# EAGLE design zerocam2S_revD (EAGLE 9.6.1)
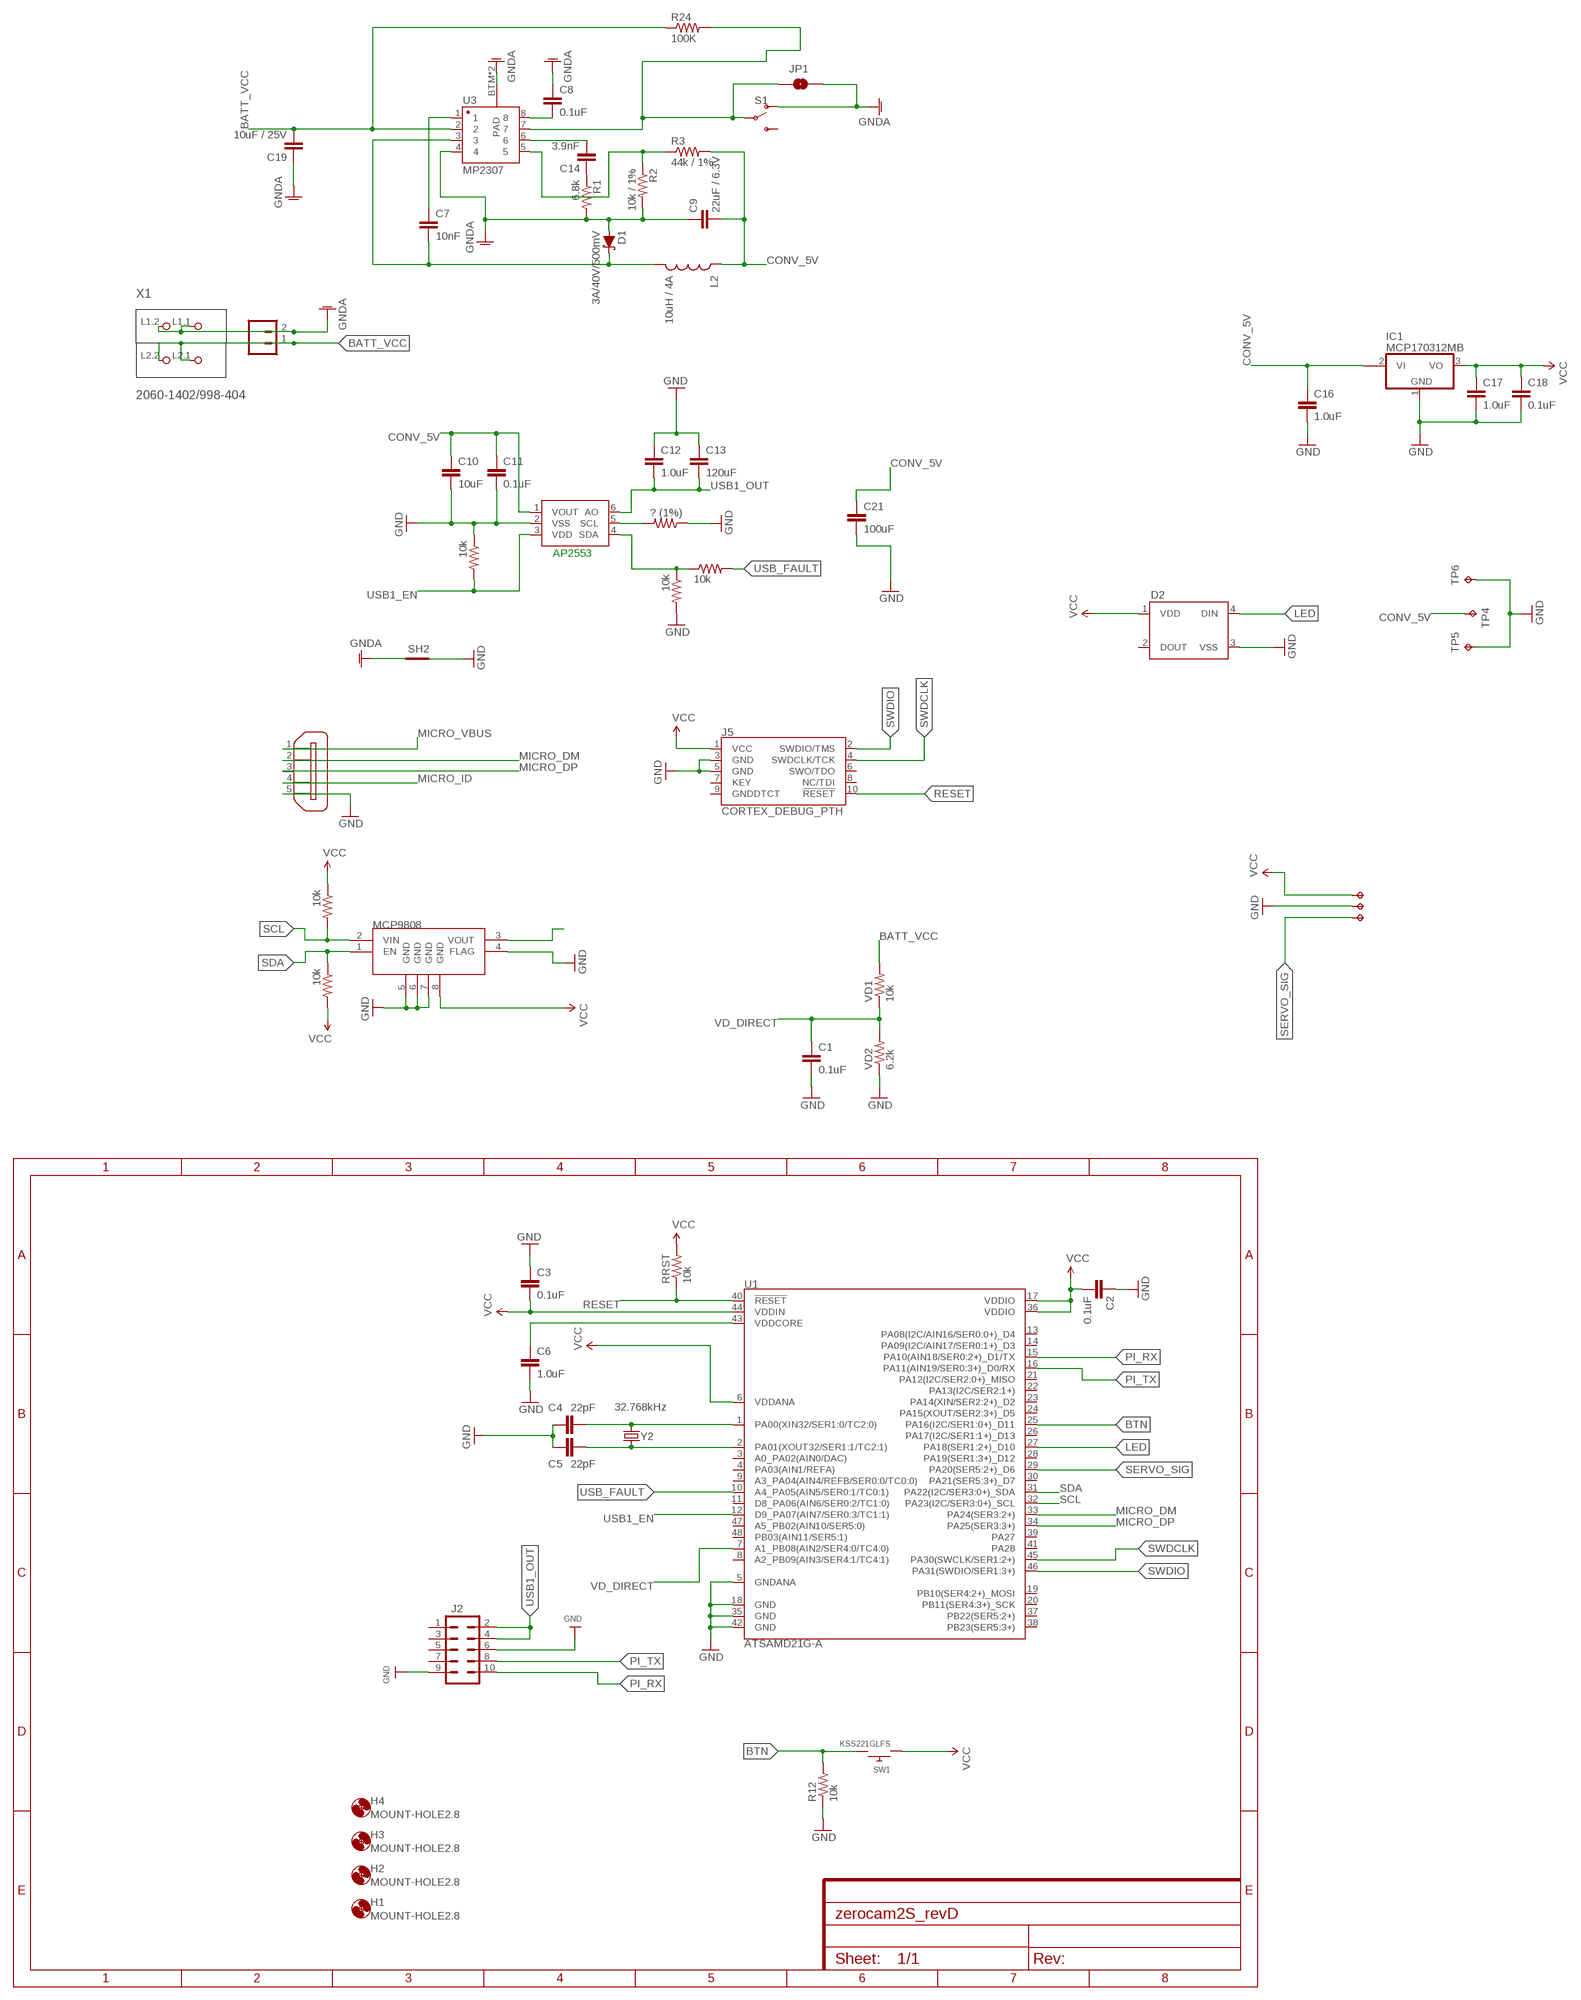
[diagram p0: schematic, sheet 1]

## Parts
AP2553  MCP4725  MCP4725SOT-23  [SOT23-6]
C1  0.1uF  CAP0805  [0805]
C2  0.1uF  1.0UF-0805-25V-10%  [0805]
C3  0.1uF  1.0UF-0805-25V-10%  [0805]
C4  22pF  CAP0805  [0805]
C5  22pF  CAP0805  [0805]
C6  1.0uF  1.0UF-0805-25V-10%  [0805]
C7  10nF  CAP0805  [0805]
C8  0.1uF  CAP1206  [1206]
C9  22uF / 6.3V  CAP1210  [1210]
C10  10uF  1.0UF-0805-25V-10%  [0805]
C11  0.1uF  1.0UF-0805-25V-10%  [0805]
C12  1.0uF  1.0UF-1206-50V-10%  [1206]
C13  120uF  1.0UF-1206-50V-10%  [1206]
C14  3.9nF  CAP1206  [1206]
C16  1.0uF  1.0UF-0805-25V-10%  [0805]
C17  1.0uF  1.0UF-1206-50V-10%  [1206]
C18  0.1uF  1.0UF-0805-25V-10%  [0805]
C19  10uF / 25V  CAP1210  [1210]
C21  100uF  10UF-1210-50V-20%  [1210]
D1  3A/40V/500mV  DIODE-SCHOTTKY-B340A  [SMA-DIODE]
D2  WS2812B  [WS2812B]
H1  MOUNT-HOLE2.8  [2,8]
H2  MOUNT-HOLE2.8  [2,8]
H3  MOUNT-HOLE2.8  [2,8]
H4  MOUNT-HOLE2.8  [2,8]
IC1  MCP170312MB  [SOT89]
J1  CONN_023.5MM-NO_SILK  [SCREWTERMINAL-3.5MM-2-NS]
J2  M05X2PTH  [AVR_ICSP]
J5  CORTEX_DEBUG_PTH  [2X5-PTH-1.27MM]
JP1  JUMPER-SMT_2_NO_NO-SILK  [SMT-JUMPER_2_NO_NO-SILK]
L2  10uH / 4A  INDUCTORSRU1038  [SRU1038]
MCP9808  V_REG_MIC5216  [MSOP8]
R1  6.8k  RESISTOR1206  [1206]
R2  10k / 1%  RESISTOR1206  [1206]
R3  44k / 1%  RESISTOR1206  [1206]
R12  10k  RESISTOR0805-RES  [0805]
R24  100K  RESISTOR1206  [1206]
R_I2C_1  10k  RESISTOR0805-RES  [0805]
R_I2C_2  10k  RESISTOR0805-RES  [0805]
R_MOSFET_USB1  ? (1%)  RESISTOR0805-RES  [0805]
R_MOSFET_USB2  10k  RESISTOR0805-RES  [0805]
R_MOSFET_USB3  10k  RESISTOR0805-RES  [0805]
R_MOSFET_USB4  10k  RESISTOR0805-RES  [0805]
RRST  10k  RESISTOR0805-RES  [0805]
S1  SWITCH-SPDT-SMD-RIGHT-ANGLE  [SWITCH_SPST_SMD_A]
SH2  SHORT-HT5  [SHORT_TOP-50]
SW1  KSS221GLFS  SWITCH_PUSHBUTTONC&K_KSS  [BTN_CK_KSS]
TP1  TPPAD1-13Y  [P1-13Y]
TP2  TPPAD1-13Y  [P1-13Y]
TP3  TPPAD1-13Y  [P1-13Y]
TP4  TPB2,54  [B2,54]
TP5  TPB2,54  [B2,54]
TP6  TPB2,54  [B2,54]
U1  ATSAMD21G-A  [TQFP-48]
U3  MP2307  GENERIC-SOIC8MSGEQ7N-FILTER  [SO08]
VD1  10k  RESISTOR0805-RES  [0805]
VD2  6.2k  RESISTOR0805-RES  [0805]
X1  2060-1402/998-404  [P-2060-1402/998-404]
X2  ZX62D-B-5PA8  [ZX62D-B-5PA8]
Y2  32.768kHz  CRYSTAL3.2X1.5MM  [CRYSTAL-SMD-3.2X1.5MM]

## Nets
BATT_VCC: C19.2 J1.1 R24.1 U3.2 VD1.2 X1.L2.1(P2.1) X1.L2.2(P2.2)
BTN: R12.2 SW1.P$2 U1.25(PA16(I2C/SER1:0+)_D11)
CONV_5V [power]: AP2553.1(VOUT) C9.2 C10.1 C11.1 C16.1 C21.1 IC1.2@1(VI1) L2.1 R3.2 TP4.TP
GND: AP2553.2(VSS) C1.2 C2.1 C3.1 C4.1 C5.1 C6.2 C10.2 C11.2 C12.1 C13.1 C16.2 C17.2 C18.2 C21.2 D2.3(VSS) IC1.1(GND) J2.6 J2.9 J5.3(GND) J5.5(GND) MCP9808.4(FLAG) MCP9808.5(GND) MCP9808.6(GND) MCP9808.7(GND) R12.1 R_MOSFET_USB1.1 R_MOSFET_USB2.2 R_MOSFET_USB3.1 SH2.2 TP2.TP TP5.TP TP6.TP U1.5(GNDANA) U1.18(GND) U1.35(GND) U1.42(GND) VD2.1 X2.5
GNDA [power]: C8.1 C9.1 C19.1 D1.A J1.2 JP1.2 R1.2 R2.2 S1.1(O) SH2.1 U3.4 U3.BTM(PAD) U3.P$1(PAD) X1.L1.1(P1.1) X1.L1.2(P1.2)
LED: D2.4(DIN) U1.27(PA18(SER1:2+)_D10)
MICRO_DM: U1.33(PA24(SER3:2+)) X2.2
MICRO_DP: U1.34(PA25(SER3:3+)) X2.3
MICRO_ID: X2.4
MICRO_VBUS: X2.1
N$1: C6.1 U1.43(VDDCORE)
N$3: AP2553.5(SCL) R_MOSFET_USB1.2
N$4: MCP9808.3(VOUT)
N$5: AP2553.4(SDA) R_MOSFET_USB2.1 R_MOSFET_USB4.1
N$8: C4.2 U1.1(PA00(XIN32/SER1:0/TC2:0)) Y2.P$2
N$25: C8.2 U3.8
N$26 [power]: C7.2 D1.C L2.2 U3.3
N$27: C7.1 U3.1
N$28: C14.1 R1.1
N$29: C14.2 U3.6
N$30: R2.1 R3.1 U3.5
N$32: C5.2 U1.2(PA01(XOUT32/SER1:1/TC2:1)) Y2.P$1
PB_BUCK_EN: JP1.1 R24.2 S1.2(P) U3.7
PI_RX: J2.10 U1.15(PA10(AIN18/SER0:2+)_D1/TX)
PI_TX: J2.8 U1.16(PA11(AIN19/SER0:3+)_D0/RX)
RESET: J5.10(!RESET) RRST.1 U1.40(!RESET!)
SCL: MCP9808.2(VIN) R_I2C_1.2 U1.32(PA23(I2C/SER3:0+)_SCL)
SDA: MCP9808.1(EN) R_I2C_2.1 U1.31(PA22(I2C/SER3:0+)_SDA)
SERVO_SIG: TP3.TP U1.29(PA20(SER5:2+)_D6)
SWDCLK: J5.4(SWDCLK/TCK) U1.45(PA30(SWCLK/SER1:2+))
SWDIO: J5.2(SWDIO/TMS) U1.46(PA31(SWDIO/SER1:3+))
USB1_EN: AP2553.3(VDD) R_MOSFET_USB3.2 U1.12(D9_PA07(AIN7/SER0:3/TC1:1))
USB1_OUT [power]: AP2553.6(AO) C12.2 C13.2 J2.2 J2.4
USB_FAULT: R_MOSFET_USB4.2 U1.10(A4_PA05(AIN5/SER0:1/TC0:1))
VCC [power]: C2.2 C3.2 C17.1 C18.1 D2.1(VDD) IC1.3(VO) J5.1(VCC) MCP9808.8(GND) R_I2C_1.1 R_I2C_2.2 RRST.2 SW1.P$1 TP1.TP U1.6(VDDANA) U1.17(VDDIO) U1.36(VDDIO) U1.44(VDDIN)
VD_DIRECT: C1.1 U1.7(A1_PB08(AIN2/SER4:0/TC4:0)) VD1.1 VD2.2
Unconnected: D2.2(DOUT) IC1.2(VI) J2.1 J2.3 J2.5 J2.7 J5.6(SWO/TDO) J5.7(KEY) J5.8(NC/TDI) J5.9(GNDDTCT) S1.3(S) U1.3(A0_PA02(AIN0/DAC)) U1.4(PA03(AIN1/REFA)) U1.8(A2_PB09(AIN3/SER4:1/TC4:1)) U1.9(A3_PA04(AIN4/REFB/SER0:0/TC0:0)) U1.11(D8_PA06(AIN6/SER0:2/TC1:0)) U1.13(PA08(I2C/AIN16/SER0:0+)_D4) U1.14(PA09(I2C/AIN17/SER0:1+)_D3) U1.19(PB10(SER4:2+)_MOSI) U1.20(PB11(SER4:3+)_SCK) U1.21(PA12(I2C/SER2:0+)_MISO) U1.22(PA13(I2C/SER2:1+)) U1.23(PA14(XIN/SER2:2+)_D2) U1.24(PA15(XOUT/SER2:3+)_D5) U1.26(PA17(I2C/SER1:1+)_D13) U1.28(PA19(SER1:3+)_D12) U1.30(PA21(SER5:3+)_D7) U1.37(PB22(SER5:2+)) U1.38(PB23(SER5:3+)) U1.39(PA27) U1.41(PA28) U1.47(A5_PB02(AIN10/SER5:0)) U1.48(PB03(AIN11/SER5:1)) X2.S1 X2.S2 X2.S3 X2.S4

## Notes on the sheet
- AP2553

## Library data of the parts
AP2553 = SparkFun-IC-Conversion:MCP4725: MCP4725 DAC Microchip 12-bit I2C DAC, SOT23-6 Datasheet <https://cdn.sparkfun.com/datasheets/BreakoutBoards/MCP4725_2009.pdf> SparkFun Products SparkFun I2C DAC Breakout - MCP4725 <https://www.sparkfun.com/products/12918> (BOB-12918); PROD_ID: IC-08886
C1 C7-C9 C14 C19 = SparkFun-Capacitors:CAP: Capacitor Standard 0603 ceramic capacitor, and 0.1" leaded capacitor.
C2 C3 C10 C11 C18 = SparkFun-Capacitors:1.0UF: 1µF ceramic capacitors A capacitor is a passive two-terminal electrical component used to store electrical energy temporarily in an electric field.; PROD_ID: CAP-08064; VALUE: 1.0uF
C4 C5 = SparkFun-Passives:CAP: Capacitor Standard 0603 ceramic capacitor, and 0.1" leaded capacitor.
C6 C16 = SparkFun-Capacitors:1.0UF: 1µF ceramic capacitors A capacitor is a passive two-terminal electrical component used to store electrical energy temporarily in an electric field.; PROD_ID: CAP-08064
C12 C17 = SparkFun-Capacitors:1.0UF: 1µF ceramic capacitors A capacitor is a passive two-terminal electrical component used to store electrical energy temporarily in an electric field.; PROD_ID: CAP-09822
C13 = SparkFun-Capacitors:1.0UF: 1µF ceramic capacitors A capacitor is a passive two-terminal electrical component used to store electrical energy temporarily in an electric field.; PROD_ID: CAP-09822; VALUE: 1.0uF
C21 = SparkFun-Capacitors:10UF: 10.0µF ceramic capacitors A capacitor is a passive two-terminal electrical component used to store electrical energy temporarily in an electric field.; PROD_ID: CAP-09824; VALUE: 10uF
D1 = SparkFun-DiscreteSemi:DIODE-SCHOTTKY: Schottky diode A Schottky diode is a semiconductor diode which has a low forward voltage drop and a very fast switching action.; PROD_ID: DIO-09886
D2 = SparkFun-LED:WS2812B: WS2812B - Intelligent control LED integrated light source Technical Specifications: Power Supply Voltage (VDD): 3.5 to 5.3 V Input Voltage (VI): -0.5 to VDD+0.5 V Operating Junction Temperature (Topt): -25°C to +80°C Storage Temperature Range (Tstg): -55°C to +150°C; PROD_ID: DIO-12503
H1-H4 = holes:MOUNT-HOLE: MOUNTING HOLE with drill center marker
IC1 = linear:MCP1703*: 250 mA, 16V, Low Quiescent Current LDO Regulator Source: http://ww1.microchip.com/downloads/en/DeviceDoc/22049b.pdf
J1 = SparkFun-Connectors:CONN_02: Multi connection point. Often used as Generic Header-pin footprint for 0.1 inch spaced/style header connections On any of the 0.1 inch spaced packages, you can populate with these: Break Away Headers - Straight <https://www.sparkfun.com/products/116> (PRT-00116) Break Away Male Headers - Right Angle <https://www.sparkfun.com/products/553> (PRT-00553) Female Headers <https://www.sparkfun.com/products/115> (PRT-00115) Break Away Headers - Machine Pin <https://www.sparkfun.com/products/117> (PRT-00117) Break Away Female Headers - Swiss Machine Pin <https://www.sparkfun.com/products/743> (PRT-00743) For SCREWTERMINALS and SPRING TERMINALS visit here: Screw Terimnals on SparkFun.com <https://www.sparkfun.com/search/results?term=Screw+Terminals> (5mm/3.5mm/2.54mm spacing) This device is also useful as a general connection point to wire up your design to another part of your project. Our various solder wires solder well into these plated through hole pads. Hook-Up Wire - Assortment (Stranded, 22 AWG) <https://www.sparkfun.com/products/11375> (PRT-11375) Hook-Up Wire - Assortment (Solid Core, 22 AWG) <https://www.sparkfun.com/products/11367> (PRT-11367) View the entire wire category on our website here <https://www.sparkfun.com/categories/141> Special notes: Molex polarized connector foot print use with: PRT-08233 with associated crimp pins and housings. 2.54_SCREWTERM for use with PRT-10571. 3.5mm Screw Terminal footprints for PRT-08084 5mm Screw Terminal footprints for use with PRT-08432; PROD_ID: CONN-08399
J2 = SparkFun-Connectors:M05X2: Header 5x2 Standard 10-pin dual row 0.1" header. Commonly used with AVR-ISP. Use with Spark Fun Electronics SKU: PRT-00778
J5 = SparkFun-Connectors:CORTEX_DEBUG: Cortex Debug Connector - 10 pin Supports JTAG debug, Serial Wire debug, and Serial Wire Viewer. PTH and SMD connector options available. General Connector Information <http://infocenter.arm.com/help/topic/com.arm.doc.faqs/attached/13634/cortex_debug_connectors.pdf> Products: PTH Connector <http://www.digikey.com/product-detail/en/cnc-tech/3220-10-0100-00/1175-1627-ND/3883661> -via Digi-Key SparkFun PSoc <https://www.sparkfun.com/products/13229> SparkFun T <https://www.sparkfun.com/products/13810>
JP1 = SparkFun-Jumpers:JUMPER-SMT_2_NO: Normally open jumper This jumper has two pads in close proximity to each other. Apply solder to close the connection. Round pads are easier to solder for beginners, but are a lot larger. SparkFun Product that uses the round pads: SparkFun EL Sequencer <https://www.sparkfun.com/products/12781>
L2 = SparkFun-Passives:INDUCTOR: Inductors Basic Inductor/Choke - 0603 and 1206. Footprints are not proven and vary greatly between part numbers. INDUCTOR POWER 3.3UH 4.0A SMD 0.197" L x 0.197" W x 0.177" H (5.00mm x 5.00mm x 4.50mm)
MCP9808 = SparkFun-IC-Power:V_REG_MIC5216: 500mA LDO, MSOP8 for better dissipation; PROD_ID: IC-09527
R1-R3 R24 = SparkFun-Resistors:RESISTOR: Resistor Basic schematic elements and footprints for 0603, 1206, and PTH resistors.
R12 R_I2C_1 R_I2C_2 R_MOSFET_USB1-R_MOSFET_USB4 RRST VD1 VD2 = SparkFun-Passives:RESISTOR: Resistor Basic schematic elements and footprints for 0603, 1206, and PTH resistors.
S1 = SparkFun-Switches:SWITCH-SPDT: Single Pole, Double Throw (SPDT) Switch Single-pole, double-throw (SPDT) switch. Variant Overview SMD-AYZ0202 Surface Mount DPDT Switch <https://www.sparkfun.com/products/597> (COM-00597) Used on e.g. LilyPad Arduino USB - ATmega32U4 Board <https://www.sparkfun.com/products/12049> PTH-11.6X4.0MM SPDT Mini Power Switch <https://www.sparkfun.com/products/102> (COM-00102) Used on e.g. SparkFun Simon Says - Through-Hole Soldering Kit <https://www.sparkfun.com/products/10547> (KIT-10547) PTH-11.6X4.0MM-KIT KIT version of SPDT Mini Power Switch - Simplifies soldering by removing tStop of switch pins - only one side can be soldered. PTH-11.6X4.0MM-LOCK LOCK version of SPDT Mini Power Switch - Offset pins hold switch in place for easier soldering. SMD-RIGHT-ANGLE Surface Mount Right Angle Switch <https://www.sparkfun.com/products/10860> (COM-10860) Used on e.g. SparkFun ESP8266 Thing <https://www.sparkfun.com/products/13231>; PROD_ID: SWCH-10651; SF_SKU: COM-10860
SH2 = shorts:SHORT-H: Short between two nets; BOM: no
SW1 = adafruit:SWITCH_PUSHBUTTON: Buttons SOFTTOUCHSMD_SJ - Soft touch temporary push button (Super Junk Akihabara) Compatible with SKPMANE010 [Mouser: 688-SKPMAN] C&K_KSS = Digikey: KSS221GLFS
TP1-TP6 = testpad:TP: Test pad
U1 = SparkFun-IC-Microcontroller:ATSAMD21G: Atmel SAMD21G SMART ARM-Based Microcontroller The Atmel ® | SMART ™ SAM D21 is a series of low-power microcontrollers using the 32-bit ARM ® Cortex ® -M0+ processor, and ranging from 32- to 64-pins with up to 256KB Flash and 32KB of SRAM. The SAM D21 devices operate at a maximum frequency of 48MHz and reach 2.46 CoreMark/MHz. They are designed for simple and intuitive migration with identical peripheral modules, hex compatible code, identical linear address map and pin compatible migration paths between all devices in the product series. All devices include intelligent and flexible peripherals, Atmel Event System for inter-peripheral signaling, and support for capacitive touch button, slider and wheel user interfaces. Datasheet <https://cdn.sparkfun.com/datasheets/Dev/Arduino/Boards/Atmel-42181-SAM-D21_Datasheet.pdf> SparkFun Products SparkFun SAMD21 Mini Breakout <https://www.sparkfun.com/products/13664> (DEV-13664) SparkFun SAMD21 Dev Breakout <https://www.sparkfun.com/products/13672> (DEV-13672) (DEV-14926); PROD_ID: IC-13064
U3 = SparkFun-AnalogIC:GENERIC-SOIC8: A placeholder for generic narrow & wide SOIC8 foorptints - used on the DIP adapter board.; PROD_ID: IC-10141
X1 = con-wago_2060:2060-1402/998-404: Serie 2060, THR-Leiterplattenklemme mit Betätigungsdrückern im Gurt 2-polig / Series 2060, THR terminal block with push-buttons in tape-and-reel packing 2-pole Polzahl / Pole No.: 2 Rastermaß / Pitch: 4 mm Bemessungsspannung / Rated Voltage: 160 V Nennstrom / Nominal Current: 9 A Leiterquerschnitt / Conductor Size: 0.2 - 0.75 mm2 Anschlusstechnik / Connection Technology: CAGE CLAMP® S Leitereinführung (zur Platine) / Conductor entry angle (to PCB): 0 ° Farbe / Color: lichtgrau / light gray Stand: 01.01.2014. Die jeweils aktuellen Daten zu diesem Artikel finden Sie in unserem Produktkatalog, den Sie unter www.wago.com einsehen können. As of: 01/01/2014. Please find the newest data for this article in our product catalogue, which can be viewed under www.wago.com.
X2 = zx62d-b-5pa8-oshpark_10:ZX62D-B-5PA8: Micro USB Type B Connector - Standard, Shell Through Hole Source: http://www.hirose.co.jp/cataloge_hp/ed_ZX_20140804.pdf; MF: Hirose; MPN: ZX62D-B-5PA8; OC_FARNELL: 2300438; OC_NEWARK: 69W0712
Y2 = samd21-temp:CRYSTAL: Various standard crystals. Proven footprints.; PROD_ID: XTAL-13062

## Net classes
1 power: width 0.254 mm, clearance 0.203 mm
2 hub_power: width 0.584 mm, clearance 0.254 mm
4 highpower: clearance 0.305 mm

## Board
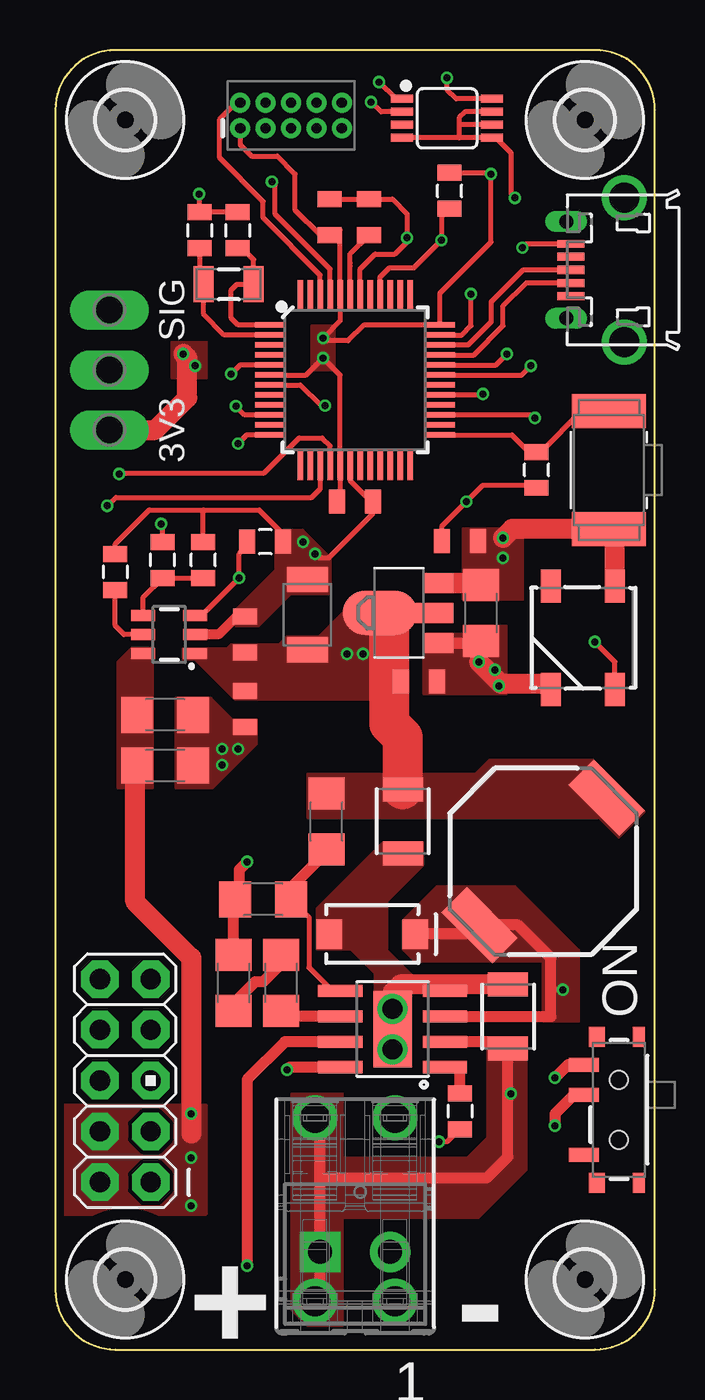
[diagram p1: board, top side]
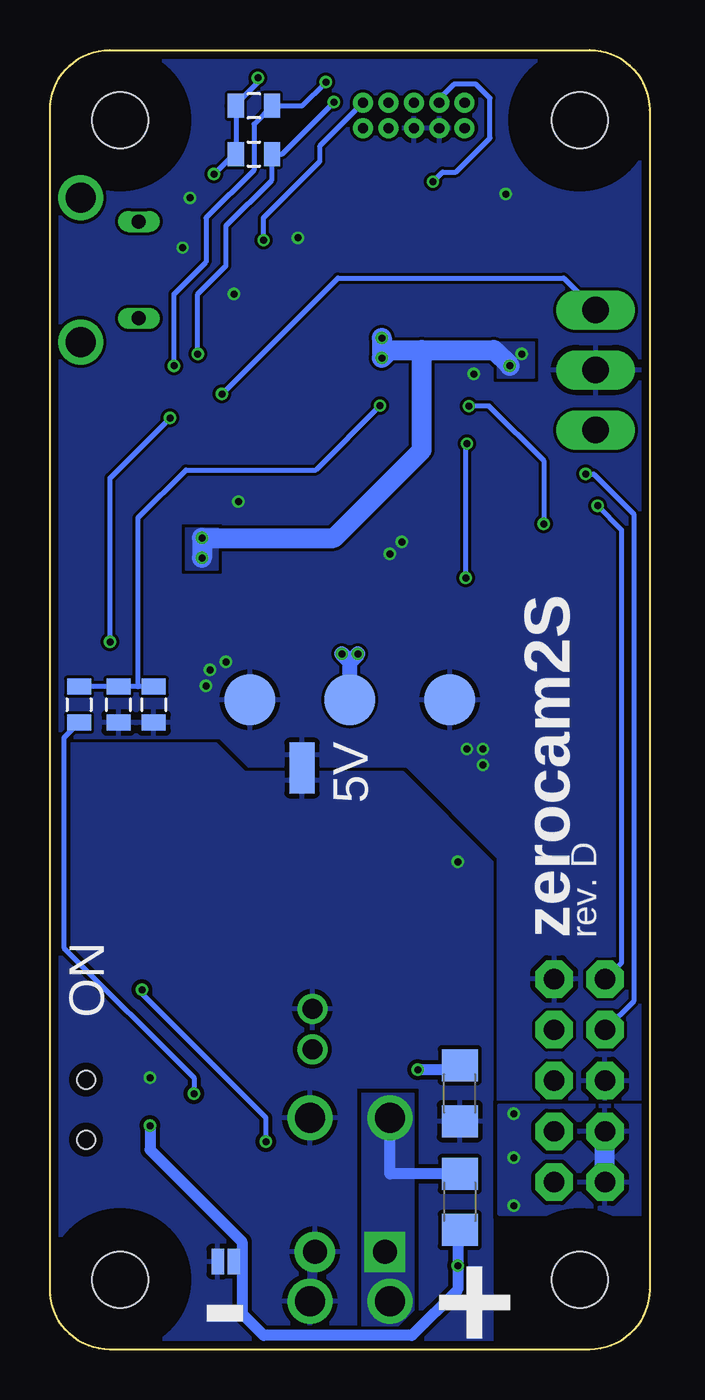
[diagram p2: board, bottom side, seen from below]

Size 30 x 65 mm. Coordinates in mm from the lower left corner, seen from the top.
Outline: 27,65 3,65 arc90 0,62 0,3 arc90 3,0 27,0 arc90 30,3 30,62 arc90 27,65
Copper layers (1*16): Top 0.035559375mm / dielectric 1.6mm / Bottom 0.035559375mm
Design rules "oshpark-2layer": minimum track width 6mil, minimum drill 10mil, track to track 6mil, track to pad 6mil, pad to pad 6mil, via to via 6mil, smd to smd 6mil, copper to edge 15mil, drill to drill 6mil, minimum pad ring 5mil, minimum via ring 5mil, stop-mask expansion 2.5mil, vias tented up to drill 0mil, thermal gap 10mil

### Footprints (pad centres in the part's own frame; a part is rotated, then mirrored left to right if it is on the bottom)
SOT23-6 = smd 0.55 x 1.2: 1 0.95,1.3; 2 0,1.3; 3 -0.95,1.3; 4 -0.95,-1.3; 5 0,-1.3; 6 0.95,-1.3
0805 = smd 0.8 x 1.2: 1 -0.9,0; 2 0.9,0
1206 = smd 1.6 x 1.8: 1 -1.4,0; 2 1.4,0
1210 = smd 1.2 x 2: 1 -1.6,0; 2 1.6,0
1210' = smd 1.27 x 2.06: 1 -1.755,0; 2 1.755,0
SMA-DIODE = smd 1.27 x 1.47: A -2.15,0; C 2.15,0
WS2812B = smd 1.651 x 1: 1 -2.577,1.6; 2 -2.577,-1.6; 3 2.577,-1.6; 4 2.577,1.6
2,8 = hole 2.8: 0,0
SOT89 = smd 1 x 1.5: 1 -1.499,-1.981; 3 1.499,-1.981 | smd 1 x 2: 2 0,-1.727 | smd 2.2 x 3.7: 2@1 0,0.94
SCREWTERMINAL-3.5MM-2-NS = drill 1.2 pad 2.032 square: 1 0,0 | drill 1.2 pad 2.032: 2 3.5,0
AVR_ICSP = drill 1.016 pad 1.88 octagon: 1 -1.27,5.08; 2 1.27,5.08; 3 -1.27,2.54; 4 1.27,2.54; 5 -1.27,0; 6 1.27,0; 7 -1.27,-2.54; 8 1.27,-2.54; 9 -1.27,-5.08; 10 1.27,-5.08
2X5-PTH-1.27MM = drill 0.508 pad 1: 1 -2.54,-0.635; 2 -2.54,0.635; 3 -1.27,-0.635; 4 -1.27,0.635; 5 0,-0.635; 6 0,0.635; 7 1.27,-0.635; 8 1.27,0.635; 9 2.54,-0.635; 10 2.54,0.635
SMT-JUMPER_2_NO_NO-SILK = smd 0.635 x 1.27: 1 -0.406,0; 2 0.406,0
SRU1038 = smd 1.8 x 3.6: 1 -4.5,0; 2 4.5,0
MSOP8 = smd 0.4 x 1.1: 1 -0.975,-2.25; 2 -0.325,-2.25; 3 0.325,-2.25; 4 0.975,-2.25; 5 0.975,2.25; 6 0.325,2.25; 7 -0.325,2.25; 8 -0.975,2.25
SWITCH_SPST_SMD_A = smd 0.7 x 1.5: 1 -2.25,-1.75; 2 -0.75,-1.75; 3 2.25,-1.75 | smd 1 x 0.6: GND1 -3.65,1; GND3 3.65,1 | smd 1 x 0.8: GND2 -3.65,-1.1; GND4 3.65,-1.1 | hole 0.9: -1.5,0; 1.5,0
SHORT_TOP-50 = smd 1.27 x 1.27: 1 0.635,0; 2 -0.635,0
BTN_CK_KSS = smd 1.7 x 3.7: P$1 -2.95,0; P$2 2.95,0
P1-13Y = drill 1.321 pad 1.905 long: TP 0,0
B2,54 = smd 2.54 x 2.54: TP 0,0
TQFP-48 = smd 1.5 x 0.28: 1 -4.25,2.75; 2 -4.25,2.25; 3 -4.25,1.75; 4 -4.25,1.25; 5 -4.25,0.75; 6 -4.25,0.25; 7 -4.25,-0.25; 8 -4.25,-0.75; 9 -4.25,-1.25; 10 -4.25,-1.75; 11 -4.25,-2.25; 12 -4.25,-2.75; 25 4.25,-2.75; 26 4.25,-2.25; 27 4.25,-1.75; 28 4.25,-1.25; 29 4.25,-0.75; 30 4.25,-0.25; 31 4.25,0.25; 32 4.25,0.75; 33 4.25,1.25; 34 4.25,1.75; 35 4.25,2.25; 36 4.25,2.75 | smd 0.28 x 1.5: 13 -2.75,-4.25; 14 -2.25,-4.25; 15 -1.75,-4.25; 16 -1.25,-4.25; 17 -0.75,-4.25; 18 -0.25,-4.25; 19 0.25,-4.25; 20 0.75,-4.25; 21 1.25,-4.25; 22 1.75,-4.25; 23 2.25,-4.25; 24 2.75,-4.25; 37 2.75,4.25; 38 2.25,4.25; 39 1.75,4.25; 40 1.25,4.25; 41 0.75,4.25; 42 0.25,4.25; 43 -0.25,4.25; 44 -0.75,4.25; 45 -1.25,4.25; 46 -1.75,4.25; 47 -2.25,4.25; 48 -2.75,4.25
SO08 = smd 0.61 x 2.21: 1 -1.905,-2.616; 2 -0.635,-2.616; 3 0.635,-2.616; 4 1.905,-2.616; 5 1.905,2.616; 6 0.635,2.616; 7 -0.635,2.616; 8 -1.905,2.616 | smd 3.81 x 1.93: BTM 0,0 | drill 1: P$1 1.016,0; P$2 -1.016,0
P-2060-1402/998-404 = drill 1.5: L1.1 4.595,2; L1.2 -4.595,2; L2.1 4.595,-2; L2.2 -4.595,-2
ZX62D-B-5PA8 = smd 1.35 x 0.4: 1 4.825,1.3; 2 4.825,0.65; 3 4.825,0; 4 4.825,-0.65; 5 4.825,-1.3 | drill 1.5: S1 2.15,-3.6; S2 2.15,3.6 | drill 0.7 long: S3 5.05,2.425; S4 5.05,-2.425
CRYSTAL-SMD-3.2X1.5MM = smd 1 x 1.8: P$1 -1.25,0; P$2 1.25,0

### Placement (x,y rotation side)
AP2553  5.7,35.76 270 top
C1  24.8,32.26 270 bottom
C2  14.99,42.42 180 top
C3  13.71,56.64 270 top
C4  9.12,55.99 270 top
C5  7.22,55.99 270 top
C6  15.69,56.64 90 top
C7  20.25,11.92 270 top
C8  9.5,12.82 90 bottom
C9  17.38,26.43 90 top
C10  9.5,32.04 270 top
C11  9.5,35.76 90 top
C12  5.48,29.21 180 top
C13  5.48,31.75 180 top
C14  11.28,18.33 270 top
C16  18.18,33.42 0 top
C17  21.28,36.84 270 top
C18  20.25,40.44 180 top
C19  22.64,16.66 270 top
C21  100uF  [1210']  12.61,36.76 90 top
D1  15.86,20.78 0 top
D2  26.4,35.6 270 top
H1  3.5,3.5 0 top
H2  26.5,3.5 0 top
H3  3.5,61.5 0 top
H4  26.5,61.5 0 top
IC1  17.18,36.84 90 top
J1  13.25,4.88 0 top
J2  3.5,13.45 180 top
J5  11.79,61.72 0 top
JP1  21.2,4.4 180 bottom
L2  24.4,24.41 225 top
MCP9808  19.6,61.58 270 top
R1  8.93,18.33 90 top
R2  10.39,22.52 180 top
R3  13.56,26.41 90 top
R12  24.07,44 90 top
R24  9.5,7.38 270 bottom
R_I2C_1  19.8,59.8 0 bottom
R_I2C_2  19.8,62.2 180 bottom
R_MOSFET_USB1  3,38.9 270 top
R_MOSFET_USB2  7.39,39.5 90 top
R_MOSFET_USB3  10.5,40.41 180 top
R_MOSFET_USB4  5.36,39.5 90 top
RRST  19.72,57.96 90 top
S1  28.2,12 270 top
SH2  17.39,29.09 270 bottom
SW1  27.7,44 90 top
TP1  2.7,46 90 top
TP2  2.7,49 90 top
TP3  2.7,52 90 top
TP4  15,32.5 0 bottom
TP5  20,32.5 0 bottom
TP6  10,32.5 0 bottom
U1  15,48.5 0 top
U3  16.87,16.03 90 top
VD1  28.54,32.26 270 bottom
VD2  26.57,32.26 90 bottom
X1  15,7 270 top
X2  30.61,54 180 top
Y2  8.67,53.28 0 top

### Tracks (layer width: path | path; a pad name or v marks a point on that pad's centre or on a via)
BATT_VCC  (via drill 0.35)
  Top 0.558: X1.L2.1 13.25,2.65 J1.1 13.25,8.6 | 13.25,8.6 13.25,11.35 X1.L2.2 | 13.25,8.6 21.6,8.6 22.64,9.64 C19.2
  Top 0.559: C19.2 22.31,15.39 U3.2
  Bottom 0.254: 28.75,31.15 VD1.2 29.3,30.6 29.3,20.1 22.8,13.6 v22.8,12.8
  Bottom 0.558: R24.1 12.98,8.78 13,8.8 X1.L2.2
  pour Bottom (no thermals): 14.4,1.2 12.6,1.2 11.8,2 11.8,12.8 14.4,12.8
  pour Top (no thermals): 23.6,15.6 21.6,15.6 21.6,10.6 20.6,9.6 13.8,9.6 13.8,6.6 21.2,6.6 23.6,9
  pour Top (no thermals): 14.4,12.8 11.8,12.8 11.8,2 12.6,1.2 14.4,1.2
BTN
  Top 0.254: SW1.P$2 26.35,46.95 24.3,44.9 R12.2 23.7,44.9 22.85,45.75 U1.25
CONV_5V  (via drill 0.35)
  Top 0.508: IC1.2@1 17.29,35.8 17.38,35.8
  Top 0.558: C16.1 17.38,33.52 17.38,35.8
  Top 2: C9.2 17.38,30.62 16.7,31.3 16.7,36.6 16.46,36.84 IC1.2@1
  Bottom 0.75: TP4.TP 15,34.4 | 15,34.4 v15.4,34.8 | v14.6,34.8 15,34.4
  pour Top (no thermals): 12.6,28.8 12.6,26.6 27.2,26.6 28.2,25.6 29.5,26.9 26.91,29.49 21.69,29.49 21,28.8
  pour Top (no thermals): 6.4,34.5 6.4,35.1 8.6,35.1 8.8,35.3 11.2,35.3 11.6,35.7 13.2,35.7 14.4,36.9 16,36.9 16,32.5 9,32.5 7,34.5
GND  (via drill 0.35)
  Top 0.254: 3.27,39.86 R_MOSFET_USB1.1 3,40.3 4.7,42 7.4,42 | X2.5 23.55,55.3 v23.37,55.12 | 20.2,60.6 MCP9808.5 22.05,60.6 22.8,59.85 22.8,57.8 v23,57.6 | 20.2,60.6 MCP9808.4 | MCP9808.7 20.5,61.91 20.2,61.6 20.2,61.2 | 20.2,61.2 20.2,60.6 | MCP9808.6 20.25,61.26 20.2,61.2 | U1.5 9.25,49.25 v8.8,48.8 | R12.1 23.95,43.22 21.37,43.22 v20.57,42.42 19.34,41.19 C18.2 | U1.35 20.35,50.75 20.8,51.2 v20.8,52.8 | U1.18 14.75,43.45 15.78,42.42 C2.1 15.89,41.82 13.67,39.6 13.2,39.6 v13,39.8 | 7.4,42 10.2,42 11.4,40.8 R_MOSFET_USB3.1 | R_MOSFET_USB2.2 7.39,41.99 7.4,42 | C4.1 C5.1 7.22,57.78 v7.2,57.8 | U1.42 15.25,54.05 16,54.8 17,54.8 17.6,55.4 v17.6,55.6 17.6,56.8 16.86,57.54 C6.2 C3.1
  Top 0.508: AP2553.2 7.04,35.8 8.2,35.8 9.06,36.66 C11.2
  Top 0.558: IC1.1 21.18,35.35
  Top 0.762: 21.18,35.35 C17.2
  Top 1: D2.3 24.52,33.3 22.3,33.3 v21.2,34.4
  other vias: 8.35,29.23 12.4,40.4 8.35,30.03 9.15,30.03 22.2,33.2 22,34
  pour Bottom (rank 3): 0,0 30,0 30,65 0,65
  pour Top (no thermals): 18.4,32.8 22.6,32.8 22.6,36.2 21.6,36.2 21.2,35.8 18.4,35.8
  pour Top (no thermals): 11,41 11,39 9,37 9,36.2 10.2,36.2 11.8,37.8 13.8,37.8 13.8,39.6 12.4,41
  pour Top (no thermals): 6,32.6 6,28.1 7.9,28.1 10.1,30.3 10.1,31.5 8.9,31.5 7.8,32.6
GNDA  (via drill 0.35)
  Top 0.5: U3.4 19.49,18.15 19.6,18.26
  Top 0.558: R1.2 8.93,22.45 R2.2 8.99,22.59 9.2,22.8 9.2,24 v9.6,24.4 | S1.1 25.65,14.25 v25,13.6
  Top 0.559: 8.79,19.86 R1.2 | R2.2 8.99,22.37
  Top 1: C19.1 19.6,18.26 17.26,18.26 16.87,17.87 U3.P$1
  pour Bottom (rank 2): 7.62,0 30,0 30,30.27 21.74,30.27 20.3,28.84 12.39,28.84 7.93,24.37 7.93,0.31
  pour Top (no thermals): 17.8,14.6 16,14.6 16,18.8 14.8,20 13.1,20 13.1,22.1 16.4,25.4 18.4,25.4 18.4,24.2 16.6,22.4 16.6,20 17.8,18.8
LED  (via drill 0.35)
  Top 0.254: D2.4 28,34.4 v27,35.4 | v24,46.6 23.85,46.75 U1.27
  Bottom 0.254: v27,35.4 27,43.6 v24,46.6
MICRO_DM
  Top 0.254: X2.2 23.55,53.35 22.4,52.2 22.4,51.2 20.95,49.75 U1.33
MICRO_DP
  Top 0.254: U1.34 20.65,50.25 21.8,51.4 21.8,52.4 23.4,54 X2.3
N$1
  Top 0.254: U1.43 14.75,54.2 14.75,54.35 14.75,54.8 C6.1
N$3
  Top 0.254: AP2553.5 3.44,35.76 3,36.2 R_MOSFET_USB1.2
N$5
  Top 0.254: AP2553.4 4.4,37.64 R_MOSFET_USB4.1 R_MOSFET_USB2.1
N$8
  Top 0.254: U1.1 9.15,51.25 8.8,51.6 8.8,53 9.08,53.28 Y2.P$2 9.92,54.52 9.33,55.09 C4.2
N$25  (via drill 0.35)
  Top 0.558: U3.8 11.72,14.12 v11.6,14
  Bottom 0.558: C8.2 9.72,14 v11.6,14
N$26  (via drill 0.35)
  Top 0.254: C7.2 20.22,11.02 19.6,10.4 v19.2,10.4 | v25.4,18 24.8,18
  Top 0.559: U3.3 24.8,16.66 24.8,18 24.8,19.58 23.15,21.23 L2.2 20.77,20.78 D1.C
  Bottom 0.254: v19.2,10.4 19.2,11.6 25.4,17.8 v25.4,18
  pour Top (no thermals): 24.4,19.4 18,19.4 17.4,20 17.4,21.5 19.1,23.2 23,23.2 26.2,20 26.2,16.4 24.4,16.4
N$27
  Top 0.558: C7.1 20.25,14.12 U3.1
N$28
  Top 0.558: C14.1 11.28,19.28 10.4,18.4 10,18.4 8.93,17.32 R1.1
  Top 0.559: R1.1 8.93,16.66
N$29
  Top 0.559: C14.2 11.55,16.66 U3.6
N$30
  Top 0.254: R2.1 12.68,21.64 12.68,19.11 13.86,17.93 U3.5
  Top 0.559: R2.1 11.79,23.12 13.62,24.95 R3.1
N$32
  Top 0.254: U1.2 8.45,50.75 7.42,51.78 Y2.P$1 7.22,53.48 C5.2
PB_BUCK_EN  (via drill 0.35)
  Top 0.558: 11.48,15.39 9.6,13.51 v9.6,4.2 | S1.2 25.95,12.75 25,11.8 v25,11.2
  Top 0.559: U3.7 11.48,15.39
  Bottom 0.508: JP1.1 20.4,4.4
  Bottom 0.558: v25,11.2 25,10 20.4,5.4 20.4,4.4 20.4,1.8 19.31,0.71 11.89,0.71 9.6,3 v9.6,4.2 9.6,5.9 R24.2
PI_RX  (via drill 0.35)
  Top 0.254: U1.15 13.25,43.05 12.82,42.62 3.02,42.62 v2.6,42.2
  Bottom 0.254: J2.10 1.4,19.36 1.4,41 v2.6,42.2
PI_TX  (via drill 0.35)
  Top 0.254: U1.16 13.75,45.2 13.35,45.6 12.2,45.6 10.41,43.81 3.21,43.81 v3.2,43.8
  Bottom 0.254: v3.2,43.8 2.8,43.8 0.8,41.8 0.8,17.42 J2.8
RESET  (via drill 0.35)
  Top 0.254: U1.40 16.25,53.65 16.71,54.11 17.95,54.11 v19.32,55.48 19.32,56.66 RRST.1
  Bottom 0.254: J5.10 16.51,60.18 16.51,59.42 19.32,56.61 v19.32,55.48
SCL  (via drill 0.35)
  Top 0.254: MCP9808.2 16.3,61.91 v15.8,62.4 | U1.32 22.05,49.25 v22.6,49.8
  Bottom 0.254: v15.8,62.4 18.4,59.8 R_I2C_1.2 18.9,58.5 21.2,56.2 21.2,54.2 22.6,52.8 v22.6,49.8
SDA  (via drill 0.35)
  Top 0.254: MCP9808.1 17.05,62.55 v16.2,63.4 | U1.31 23.35,48.75 v23.8,49.2
  Bottom 0.254: v16.2,63.4 17.4,62.2 R_I2C_2.1 19.8,61.3 19.8,59 22.2,56.6 22.2,54.4 23.8,52.8 v23.8,49.2
SERVO_SIG  (via drill 0.35)
  Top 0.254: v21.4,47.8 21.35,47.75 U1.29
  Bottom 0.254: v21.4,47.8 15.6,53.6 4.3,53.6 TP3.TP
SWDCLK  (via drill 0.35)
  Top 0.254: U1.45 13.75,54.05 11,56.8 11,58.25 v10.83,58.42
  Bottom 0.254: v10.83,58.42 10.36,58.89 9.69,58.89 7.98,60.6 7.98,62.59 8.69,63.3 9.78,63.3 10.52,62.56 J5.4
SWDIO
  Top 0.254: J5.2 9.05,62.36 8.22,61.53 8.22,59.6 10.4,57.42 10.4,56.6 13.25,53.75 U1.46
USB1_EN  (via drill 0.35)
  Top 0.254: U1.12 9.57,45.75 v9.14,45.32 | AP2553.3 7.31,36.71 v9.2,38.6 9.2,39.81 9.6,40.21 R_MOSFET_USB3.2
  Bottom 0.254: v9.2,38.6 9.2,45.26 v9.14,45.32
USB1_OUT  (via drill 0.35)
  Top 1: 6.8,10.8 6.8,19.6 4,22.4 4,29.13 C12.2
  Bottom 1: J2.2 J2.4
  other vias: 6.8,9.6 6.8,7.2 6.8,11.8
  pour Top (no thermals): 4.9,35.1 3.8,35.1 3.1,34.4 3.1,28.1 4.9,28.1
  pour Top (no thermals): 7.5,6.8 0,6.8 0,12.2 7.5,12.2
  pour Bottom: 0,6.8 7.5,6.8 7.5,12.2 0,12.2
USB_FAULT  (via drill 0.35)
  Top 0.254: U1.10 9.47,46.75 v9.03,47.19 | R_MOSFET_USB4.2 5.36,41.3 v5.3,41.3
  Bottom 0.254: v5.3,41.3 5.3,44.46 8.03,47.19 v9.03,47.19
VCC  (via drill 0.35)
  Top 0.254: J5.1 9.25,60.25 9.81,59.69 11.11,59.69 12,58.8 12,57 13.26,55.74 C3.2 14.25,56 U1.44 14.25,51.45 v13.4,50.6 13.55,50.45 14.65,50.45 15.45,51.25 U1.36 19.25,52.85 21.8,55.4 v21.8,58.8 21.74,58.86 RRST.2 | MCP9808.8 20.05,62.55 19.6,63 v19.6,63.6 | 27.5,40.85 SW1.P$1 27.6,41.05 | C2.2 14.25,42.58 U1.17 14.25,48.75 v13.4,49.6 12.55,48.75 U1.6
  Top 1: D2.1 28,40.6 28.2,40.8 27.95,41.05 27.6,41.05 | SW1.P$1 22.85,41.05 v22.4,40.6 | v6.4,49.8 6.6,49.6 6.6,47.6 5,46 TP1.TP
  Top 1.016: C17.1 21.18,38.34 IC1.3
  Bottom 0.254: R_I2C_2.2 R_I2C_1.1 20.8,59.8 v21.8,58.8 | 21,62.2 R_I2C_2.2 | v19.6,63.6 19.6,63.4 20.7,62.3 R_I2C_2.2
  Bottom 1: v22.4,39.6 v22.4,40.6 15.8,40.6 11.4,45 11.4,50 | 11.4,50 13,50 v13.4,49.6 v13.4,50.6 | v7,49.2 7.8,50 11.4,50
  pour Top (no thermals): 23.4,37.5 20.4,37.5 20.4,41.1 23.4,41.1
  pour Bottom: 23.2,41.1 21.6,41.1 21.6,39 23.2,39
  pour Top: 12.8,49 14,49 14,51.2 12.8,51.2
  pour Bottom: 7.6,50.4 5.8,50.4 5.8,48.6 7.6,48.6
  pour Top: 7.6,50.4 5.8,50.4 5.8,48.6 7.6,48.6
VD_DIRECT  (via drill 0.35)
  Top 0.254: U1.7 12.25,48.25 13.29,47.21 v13.49,47.21
  Bottom 0.254: VD2.2 25.6,33.16 25.6,41.6 23.2,44 16.7,44 v13.49,47.21 | VD2.2 VD1.1 | VD2.2 C1.1 25,33.36

### Text on the board
tPlace: SIG | 3V3 | ON | + | -
bPlace: 5V | rev. D | zerocam2S | ON | + | -